# EAGLE schematic APU_Motherboard_Schematic (EAGLE 9.7.0)

## Sheet 1 of 2
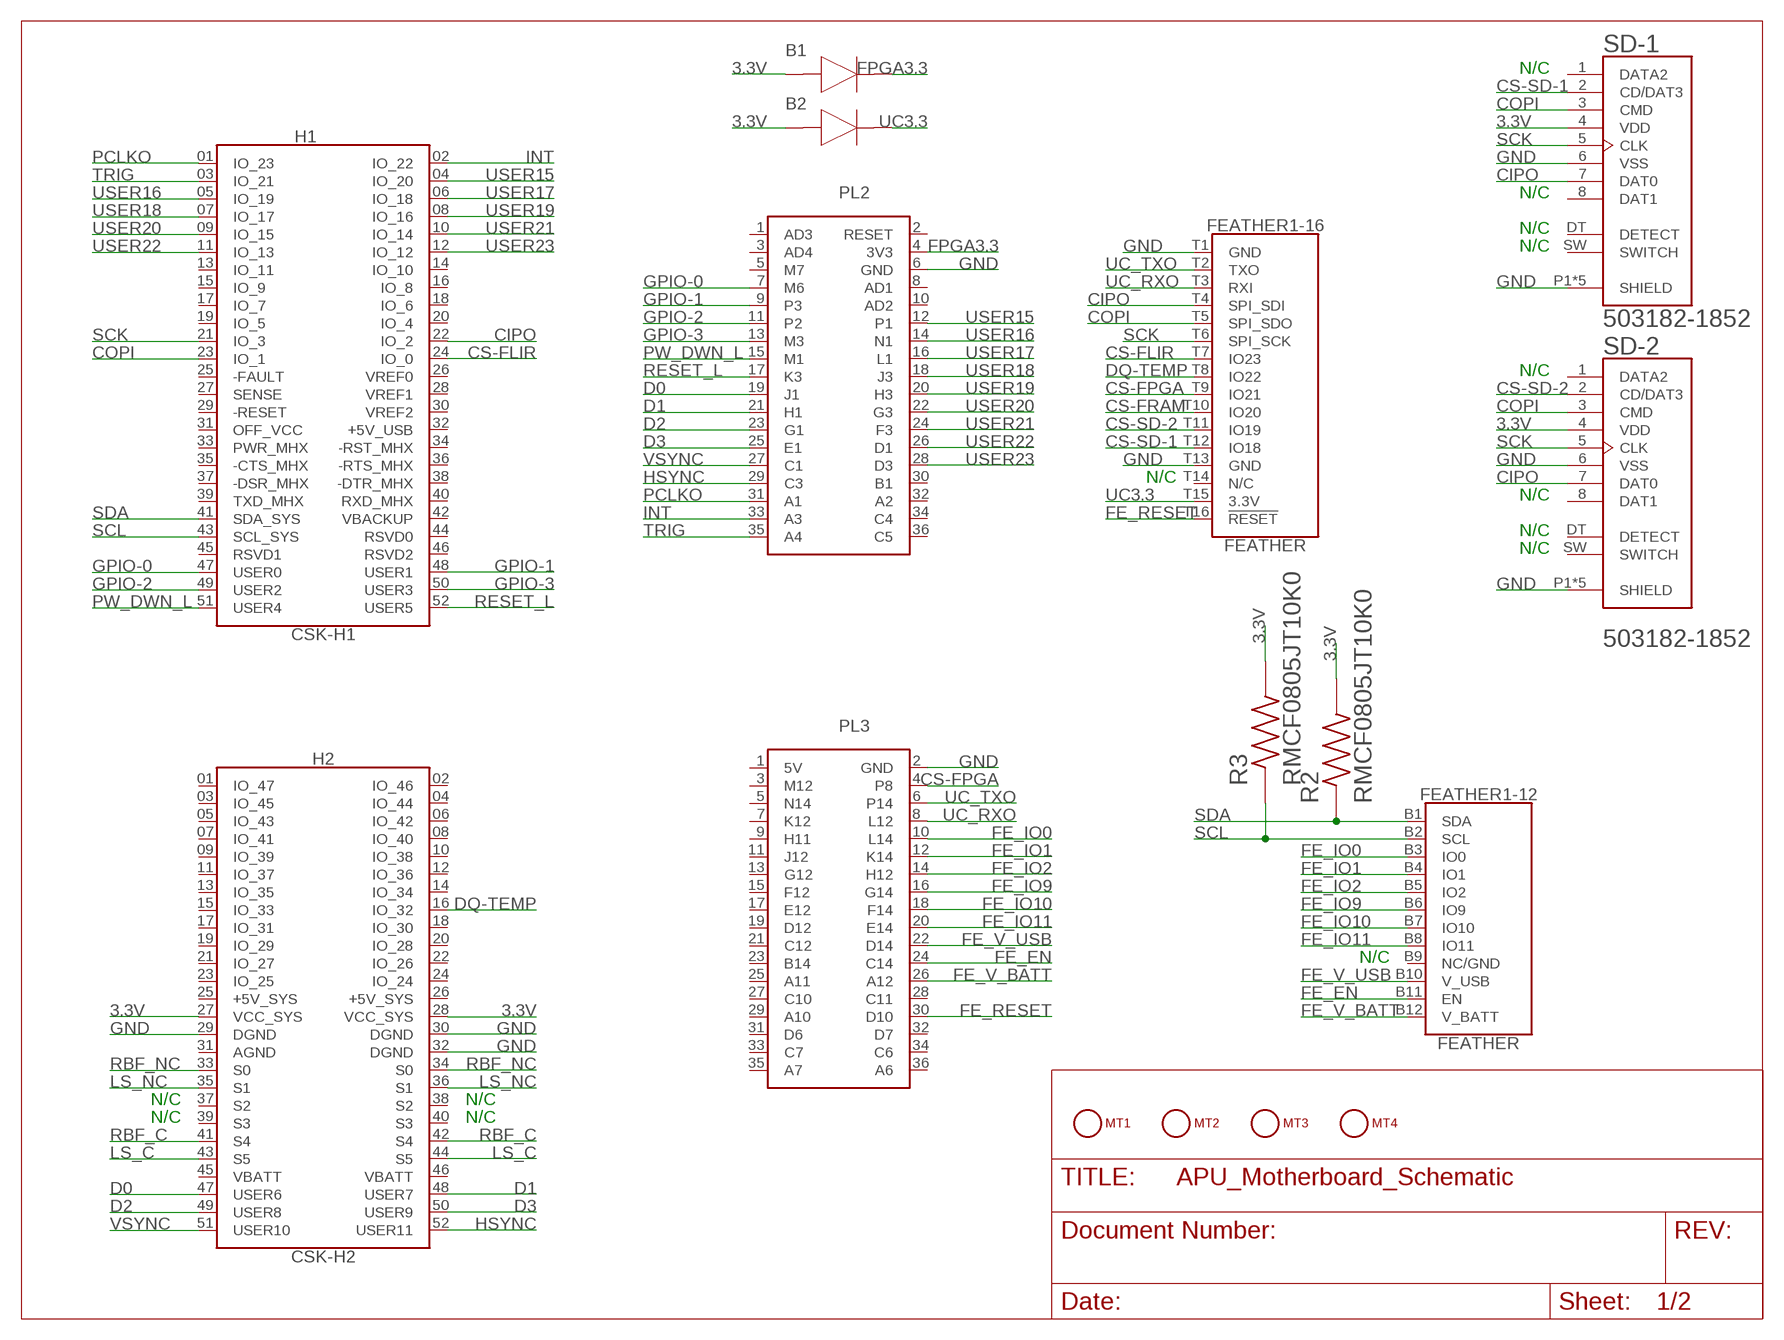
[diagram p0: schematic, sheet 1]

### Parts
B1  DIO_PMEG4030ER,115  PMEG120G10ELRX  [PMEG120G10ELRX]
B2  PMEG120G10ELRX  [PMEG120G10ELRX]
FEATHER1  FEATHER  [FEATHER]
H1  CSK-H1  [SAMTEC_ESQ-126-37-G-D--NUMBERED-FOR-CUBESAT-BUS]
H2  CSK-H2  [SAMTEC_ESQ-126-37-G-D--NUMBERED-FOR-CUBESAT-BUS]
MT1  MOUNTING_HOLE-125_250_ROUND  [MT_125_250]
MT2  MOUNTING_HOLE-125_250_ROUND  [MT_125_250]
MT3  MOUNTING_HOLE-125_250_ROUND  [MT_125_250]
MT4  MOUNTING_HOLE-125_250_ROUND  [MT_125_250]
PL2  ICEWERX-PL2  [TE_4-1734506-1]
PL3  ICEWERX-PL3  [TE_4-1734506-1]
R2  RMCF0805JT10K0  [RESC2012X65N]
R3  RMCF0805JT10K0  [RESC2012X65N]
SD-1  503182-1852  [MOLEX_503182-1852]
SD-2  503182-1852  [MOLEX_503182-1852]

### Nets
3.3V: B1.2(ANODE) B2.2(ANODE) H2.27(VCC_SYS) H2.28(VCC_SYS) R2.2 R3.2 SD-1.4(VDD) SD-2.4(VDD) ; also sheet 2
CIPO: FEATHER1.T4(-16:SPI_SDI) H1.22(IO_2) SD-1.7(DAT0) SD-2.7(DAT0) ; also sheet 2
COPI: FEATHER1.T5(-16:SPI_SDO) H1.23(IO_1) SD-1.3(CMD) SD-2.3(CMD) ; also sheet 2
CS-FLIR: FEATHER1.T7(-16:IO23) H1.24(IO_0)
CS-FPGA: FEATHER1.T9(-16:IO21) PL3.4(P8)
CS-FRAM: FEATHER1.T10(-16:IO20) ; also sheet 2
CS-SD-1: FEATHER1.T12(-16:IO18) SD-1.2(CD/DAT3)
CS-SD-2: FEATHER1.T11(-16:IO19) SD-2.2(CD/DAT3)
D0: H2.47(USER6) PL2.19(J1)
D1: H2.48(USER7) PL2.21(H1)
D2: H2.49(USER8) PL2.23(G1)
D3: H2.50(USER9) PL2.25(E1)
DQ-TEMP: FEATHER1.T8(-16:IO22) H2.16(IO_32) ; also sheet 2
FE_EN: FEATHER1.B11(-12:EN) PL3.24(C14)
FE_IO0: FEATHER1.B3(-12:IO0) PL3.10(L14)
FE_IO1: FEATHER1.B4(-12:IO1) PL3.12(K14)
FE_IO2: FEATHER1.B5(-12:IO2) PL3.14(H12)
FE_IO9: FEATHER1.B6(-12:IO9) PL3.16(G14)
FE_IO10: FEATHER1.B7(-12:IO10) PL3.18(F14)
FE_IO11: FEATHER1.B8(-12:IO11) PL3.20(E14)
FE_RESET: FEATHER1.T16(-16:!RESET) PL3.30(D10)
FE_V_BATT: FEATHER1.B12(-12:V_BATT) PL3.26(A12)
FE_V_USB: FEATHER1.B10(-12:V_USB) PL3.22(D14)
FPGA3.3: B1.1(CATHODE) PL2.4(3V3)
GND: FEATHER1.T1(-16:GND) FEATHER1.T13(-16:GND) H2.29(DGND) H2.30(DGND) H2.32(DGND) PL2.6(GND) PL3.2(GND) SD-1.6(VSS) SD-1.P1(SHIELD) SD-1.P2(SHIELD) SD-1.P3(SHIELD) SD-1.P4(SHIELD) SD-1.P5(SHIELD) SD-2.6(VSS) SD-2.P1(SHIELD) SD-2.P2(SHIELD) SD-2.P3(SHIELD) SD-2.P4(SHIELD) SD-2.P5(SHIELD) ; also sheet 2
GPIO-0: H1.47(USER0) PL2.7(M6)
GPIO-1: H1.48(USER1) PL2.9(P3)
GPIO-2: H1.49(USER2) PL2.11(P2)
GPIO-3: H1.50(USER3) PL2.13(M3)
HSYNC: H2.52(USER11) PL2.29(C3)
INT: H1.02(IO_22) PL2.33(A3)
LS_C: H2.43(S5) H2.44(S5) ; also sheet 2
LS_NC: H2.35(S1) H2.36(S1) ; also sheet 2
PCLKO: H1.01(IO_23) PL2.31(A1)
PW_DWN_L: H1.51(USER4) PL2.15(M1)
RBF_C: H2.41(S4) H2.42(S4) ; also sheet 2
RBF_NC: H2.33(S0) H2.34(S0) ; also sheet 2
RESET_L: H1.52(USER5) PL2.17(K3)
SCK: FEATHER1.T6(-16:SPI_SCK) H1.21(IO_3) SD-1.5(CLK) SD-2.5(CLK) ; also sheet 2
SCL: FEATHER1.B2(-12:SCL) H1.43(SCL_SYS) R3.1 ; also sheet 2
SDA: FEATHER1.B1(-12:SDA) H1.41(SDA_SYS) R2.1 ; also sheet 2
TRIG: H1.03(IO_21) PL2.35(A4)
UC3.3: B2.1(CATHODE) FEATHER1.T15(-16:3.3V)
UC_RXO: FEATHER1.T3(-16:RXI) PL3.8(L12)
UC_TXO: FEATHER1.T2(-16:TXO) PL3.6(P14)
USER15: H1.04(IO_20) PL2.12(P1)
USER16: H1.05(IO_19) PL2.14(N1)
USER17: H1.06(IO_18) PL2.16(L1)
USER18: H1.07(IO_17) PL2.18(J3)
USER19: H1.08(IO_16) PL2.20(H3)
USER20: H1.09(IO_15) PL2.22(G3)
USER21: H1.10(IO_14) PL2.24(F3)
USER22: H1.11(IO_13) PL2.26(D1)
USER23: H1.12(IO_12) PL2.28(D3)
VSYNC: H2.51(USER10) PL2.27(C1)
Unconnected: FEATHER1.B9(-12:NC/GND) FEATHER1.T14(-16:N/C) H1.13(IO_11) H1.14(IO_10) H1.15(IO_9) H1.16(IO_8) H1.17(IO_7) H1.18(IO_6) H1.19(IO_5) H1.20(IO_4) H1.25(-FAULT) H1.26(VREF0) H1.27(SENSE) H1.28(VREF1) H1.29(-RESET) H1.30(VREF2) H1.31(OFF_VCC) H1.32(+5V_USB) H1.33(PWR_MHX) H1.34(-RST_MHX) H1.35(-CTS_MHX) H1.36(-RTS_MHX) H1.37(-DSR_MHX) H1.38(-DTR_MHX) H1.39(TXD_MHX) H1.40(RXD_MHX) H1.42(VBACKUP) H1.44(RSVD0) H1.45(RSVD1) H1.46(RSVD2) H2.01(IO_47) H2.02(IO_46) H2.03(IO_45) H2.04(IO_44) H2.05(IO_43) H2.06(IO_42) H2.07(IO_41) H2.08(IO_40) H2.09(IO_39) H2.10(IO_38) H2.11(IO_37) H2.12(IO_36) H2.13(IO_35) H2.14(IO_34) H2.15(IO_33) H2.17(IO_31) H2.18(IO_30) H2.19(IO_29) H2.20(IO_28) H2.21(IO_27) H2.22(IO_26) H2.23(IO_25) H2.24(IO_24) H2.25(+5V_SYS) H2.26(+5V_SYS) H2.31(AGND) H2.37(S2) H2.38(S2) H2.39(S3) H2.40(S3) H2.45(VBATT) H2.46(VBATT) MT1.1 MT2.1 MT3.1 MT4.1 PL2.1(AD3) PL2.2(RESET) PL2.3(AD4) PL2.5(M7) PL2.8(AD1) PL2.10(AD2) PL2.30(B1) PL2.32(A2) PL2.34(C4) PL2.36(C5) PL3.1(5V) PL3.3(M12) PL3.5(N14) PL3.7(K12) PL3.9(H11) PL3.11(J12) PL3.13(G12) PL3.15(F12) PL3.17(E12) PL3.19(D12) PL3.21(C12) PL3.23(B14) PL3.25(A11) PL3.27(C10) PL3.28(C11) PL3.29(A10) PL3.31(D6) PL3.32(D7) PL3.33(C7) PL3.34(C6) PL3.35(A7) PL3.36(A6) SD-1.1(DATA2) SD-1.8(DAT1) SD-1.DT(DETECT) SD-1.SW(SWITCH) SD-2.1(DATA2) SD-2.8(DAT1) SD-2.DT(DETECT) SD-2.SW(SWITCH)

### Notes on the sheet
- N/C
- N/C
- N/C
- N/C
- N/C
- N/C
- N/C
- N/C
- N/C
- N/C
- N/C | N/C
- N/C | N/C

## Sheet 2 of 2
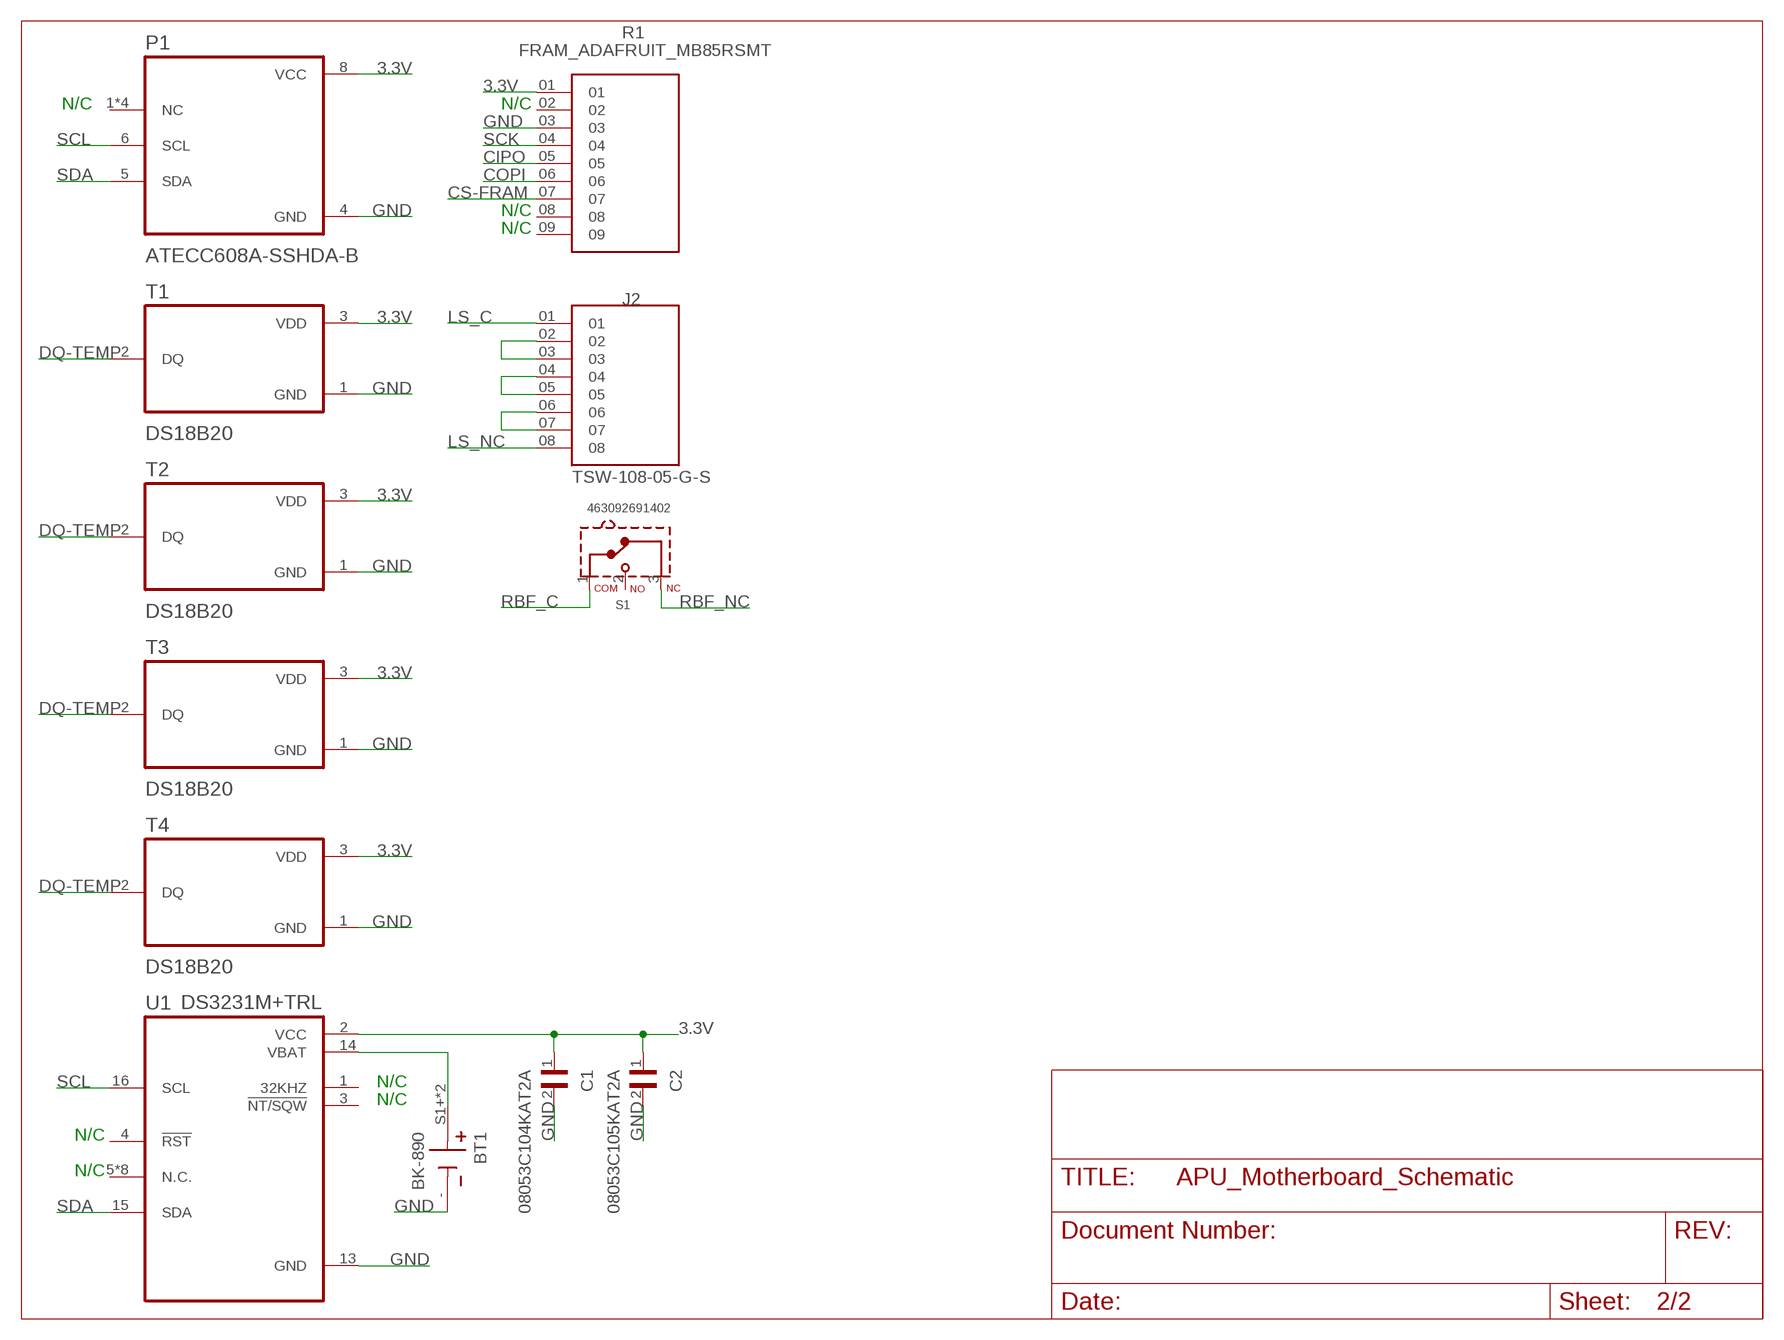
[diagram p1: schematic, sheet 2]

### Parts
BT1  BK-890  [BAT_BK-890]
C1  08053C104KAT2A  [CAPC2012X94N]
C2  08053C105KAT2A  [CAPC2012X94N]
J2  TSW-108-05-G-S  [SAMTEC_TSW-108-05-G-S]
P1  ATECC608A-SSHDA-B  [SOIC127P600X175-8N]
R1  FRAM_ADAFRUIT_MB85RSMT  [FRAM_ADAFRUIT_MB85RSMT]
S1  463092691402  [463092691402]
T1  DS18B20  DS18B20+T&R  [DS18B20+T&R]
T2  DS18B20  DS18B20+T&R  [DS18B20+T&R]
T3  DS18B20  DS18B20+T&R  [DS18B20+T&R]
T4  DS18B20  DS18B20+T&R  [DS18B20+T&R]
U1  DS3231M+TRL  [SOIC127P1032X265-16N]

### Nets
3.3V: C1.1 C2.1 P1.8(VCC) R1.01 T1.3(VDD) T2.3(VDD) T3.3(VDD) T4.3(VDD) U1.2(VCC) ; also sheet 1
CIPO: R1.05 ; also sheet 1
COPI: R1.06 ; also sheet 1
CS-FRAM: R1.07 ; also sheet 1
DQ-TEMP: T1.2(DQ) T2.2(DQ) T3.2(DQ) T4.2(DQ) ; also sheet 1
GND: BT1.- C1.2 C2.2 P1.4(GND) R1.03 T1.1(GND) T2.1(GND) T3.1(GND) T4.1(GND) U1.13(GND) ; also sheet 1
LS_C: J2.01 ; also sheet 1
LS_NC: J2.08 ; also sheet 1
N$1: BT1.S1+(+) BT1.S2+(+) U1.14(VBAT)
N$3: J2.02 J2.03
N$4: J2.04 J2.05
N$5: J2.06 J2.07
RBF_C: S1.1(COM) ; also sheet 1
RBF_NC: S1.3(NC) ; also sheet 1
SCK: R1.04 ; also sheet 1
SCL: P1.6(SCL) U1.16(SCL) ; also sheet 1
SDA: P1.5(SDA) U1.15(SDA) ; also sheet 1
Unconnected: P1.1(NC) P1.2(NC) P1.3(NC) P1.7(NC) R1.02 R1.08 R1.09 S1.2(NO) U1.1(32KHZ) U1.3(!NT/SQW) U1.4(!RST) U1.5(N.C.) U1.6(N.C.) U1.7(N.C.) U1.8(N.C.) U1.9(N.C.) U1.10(N.C.) U1.11(N.C.) U1.12(N.C.)

### Notes on the sheet
- N/C | N/C
- N/C
- N/C
- N/C
- N/C
- N/C
- N/C

## Library data of the parts
B1 B2 = apu-csk-motherboard:PMEG120G10ELRX
BT1 = apu-csk-motherboard:BK-890: BATTERY RETAINER COIN PC PIN Check availability <https://pricing.snapeda.com/parts/BK-890/MPD/view-part?ref=eda>; AVAILABILITY: In Stock; DESCRIPTION: BATTERY RETAINER COIN PC PIN; MF: MPD; MP: BK-890; PACKAGE: DFN-12 MPD; PRICE: None; PURCHASE-URL: https://pricing.snapeda.com/search/part/BK-890/?ref=eda
C1 = apu-csk-motherboard:08053C104KAT2A: Cap Ceramic 0.1uF 25V X7R 10% Pad SMD 0805 125 T/R Check availability <https://pricing.snapeda.com/parts/08053C104KAT2A/AVX/view-part?ref=eda>; AVAILABILITY: In Stock; DESCRIPTION: 0.1 µF ±10% 25V Ceramic Capacitor X7R 0805 (2012 Metric); MF: AVX; MP: 08053C104KAT2A; PACKAGE: 2012 AVX; PRICE: None; PURCHASE-URL: https://pricing.snapeda.com/search/part/08053C104KAT2A/?ref=eda
C2 = apu-csk-motherboard:08053C105KAT2A: Cap Ceramic 1uF 25V X7R 10% SMD 0805 125°C Embossed T/R Check availability <https://pricing.snapeda.com/parts/08053C105KAT2A/AVX/view-part?ref=eda>; AVAILABILITY: In Stock; DESCRIPTION: 1 µF ±10% 25V Ceramic Capacitor X7R 0805 (2012 Metric); MF: AVX; MP: 08053C105KAT2A; PACKAGE: 2012 AVX; PRICE: None; PURCHASE-URL: https://pricing.snapeda.com/search/part/08053C105KAT2A/?ref=eda
FEATHER1 = apu-csk-motherboard:FEATHER
H1 = apu-csk-motherboard:CSK-H1
H2 = apu-csk-motherboard:CSK-H2
J2 = apu-csk-motherboard:TSW-108-05-G-S: Check availability <https://pricing.snapeda.com/parts/TSW-108-05-G-S/Samtec/view-part?ref=eda>; AVAILABILITY: In Stock; DESCRIPTION: TSW - Samtec 2.54mm Pin Header 8.51mm Overall Pin Length (05) - Fast Stock; MF: Samtec; MP: TSW-108-05-G-S; PACKAGE: None; PRICE: None; PURCHASE-URL: https://pricing.snapeda.com/search/part/TSW-108-05-G-S/?ref=eda
MT1-MT4 = apu-csk-motherboard:MOUNTING_HOLE
P1 = apu-csk-motherboard:ATECC608A-SSHDA-B: None Check availability <https://pricing.snapeda.com/parts/ATECC608A-SSHDA-B/Microchip%20Technology/view-part?ref=eda>; AVAILABILITY: In Stock; DESCRIPTION: IC AUTHENTICATION CHIP 8SOIC; MF: Microchip Technology; MP: ATECC608A-SSHDA-B; PACKAGE: SOIC-8 Microchip Technology; PRICE: None; PURCHASE-URL: https://pricing.snapeda.com/search/part/ATECC608A-SSHDA-B/?ref=eda
PL2 = apu-csk-motherboard:ICEWERX-PL2
PL3 = apu-csk-motherboard:ICEWERX-PL3
R1 = apu-csk-motherboard:FRAM_ADAFRUIT_MB85RSMT
R2 R3 = apu-csk-motherboard:RMCF0805JT10K0: Check availability <https://pricing.snapeda.com/parts/RMCF0805JT10K0/Stackpole%20Electronics%20Inc/view-part?ref=eda>; AVAILABILITY: In Stock; DESCRIPTION: 10 kOhms ±5% 0.125W, 1/8W Chip Resistor 0805 (2012 Metric) Automotive AEC-Q200 Thick Film; MF: Stackpole Electronics Inc; MP: RMCF0805JT10K0; PACKAGE: 2012 Stackpole; PRICE: None; PURCHASE-URL: https://pricing.snapeda.com/search/part/RMCF0805JT10K0/?ref=eda
S1 = apu-csk-motherboard:463092691402: WS-MITV THT Terminal with Lever, Right Angle Operation Micro Switch, 12.8 x 5.8 mm Material Properties Actuator Material PBT Actuator Flammability Rating UL94 V-0 Actuator Color White Frame Material PBT Frame Flammability Rating UL94 V-0 Moveable Contact Material Silver Stationary Contact Material Silver Terminal Material Copper Alloy Terminal Plating Silver Mechanical Properties Operating Position 6.8 mm Over travel 0.55 mm Movement Differential 0.5 mm Electrical Life 10000 Cycles General Information Operating Temperature -40 up to +85 °C Packaging Properties Packaging Tray <https://www.we-online.com/catalog/media/o320310v209%20Family_WS-MITV_463092691402.jpg> Details see: https://www.we-online.com/catalog/en/MITV_THT_TERMINAL_LEVER_RIGHT_ANGLE_MICRO_SWITCH_12_8X5_8 Created by Ella Wu, 2021-03-12 2021 (C) Wurth Elektronik Check availability <https://pricing.snapeda.com/parts/463092691402/W%C3%BCrth%20Elektronik/view-part?ref=eda>; AVAILABILITY: In Stock; DESCRIPTION: Basic / Snap Action Switches WS-MITV Micro Switch RA Psh Typ 80gf; MF: Würth Elektronik; MP: 463092691402; PACKAGE: None; PRICE: None; PURCHASE-URL: https://pricing.snapeda.com/search/part/463092691402/?ref=eda
SD-1 SD-2 = apu-csk-motherboard:503182-1852: Conn Micro SD Card M 8 POS 1.09mm Solder RA SMD Embossed T/R 0.5A/Contact Check availability <https://pricing.snapeda.com/parts/5031821852/Molex/view-part?ref=eda>; AVAILABILITY: In Stock; DESCRIPTION: 10 (8 + 2) Position Card Connector Secure Digital - microSD™ Surface Mount, Right Angle Gold; MF: Molex; MP: 5031821852; PACKAGE: None; PRICE: None; PURCHASE-URL: https://pricing.snapeda.com/search/part/5031821852/?ref=eda
T1-T4 = apu-csk-motherboard:DS18B20+T&R
U1 = apu-csk-motherboard:DS3231M+TRL: Check availability <https://pricing.snapeda.com/parts/DS3231M%2BTRL/Analog%20Devices/view-part?ref=eda>; AVAILABILITY: In Stock; DESCRIPTION: ±5ppm, I2C Real-Time Clock; MF: Analog Devices; MP: DS3231M+TRL; PACKAGE: SOIC-16 Maxim; PRICE: None; PURCHASE-URL: https://pricing.snapeda.com/search/part/DS3231M+TRL/?ref=eda